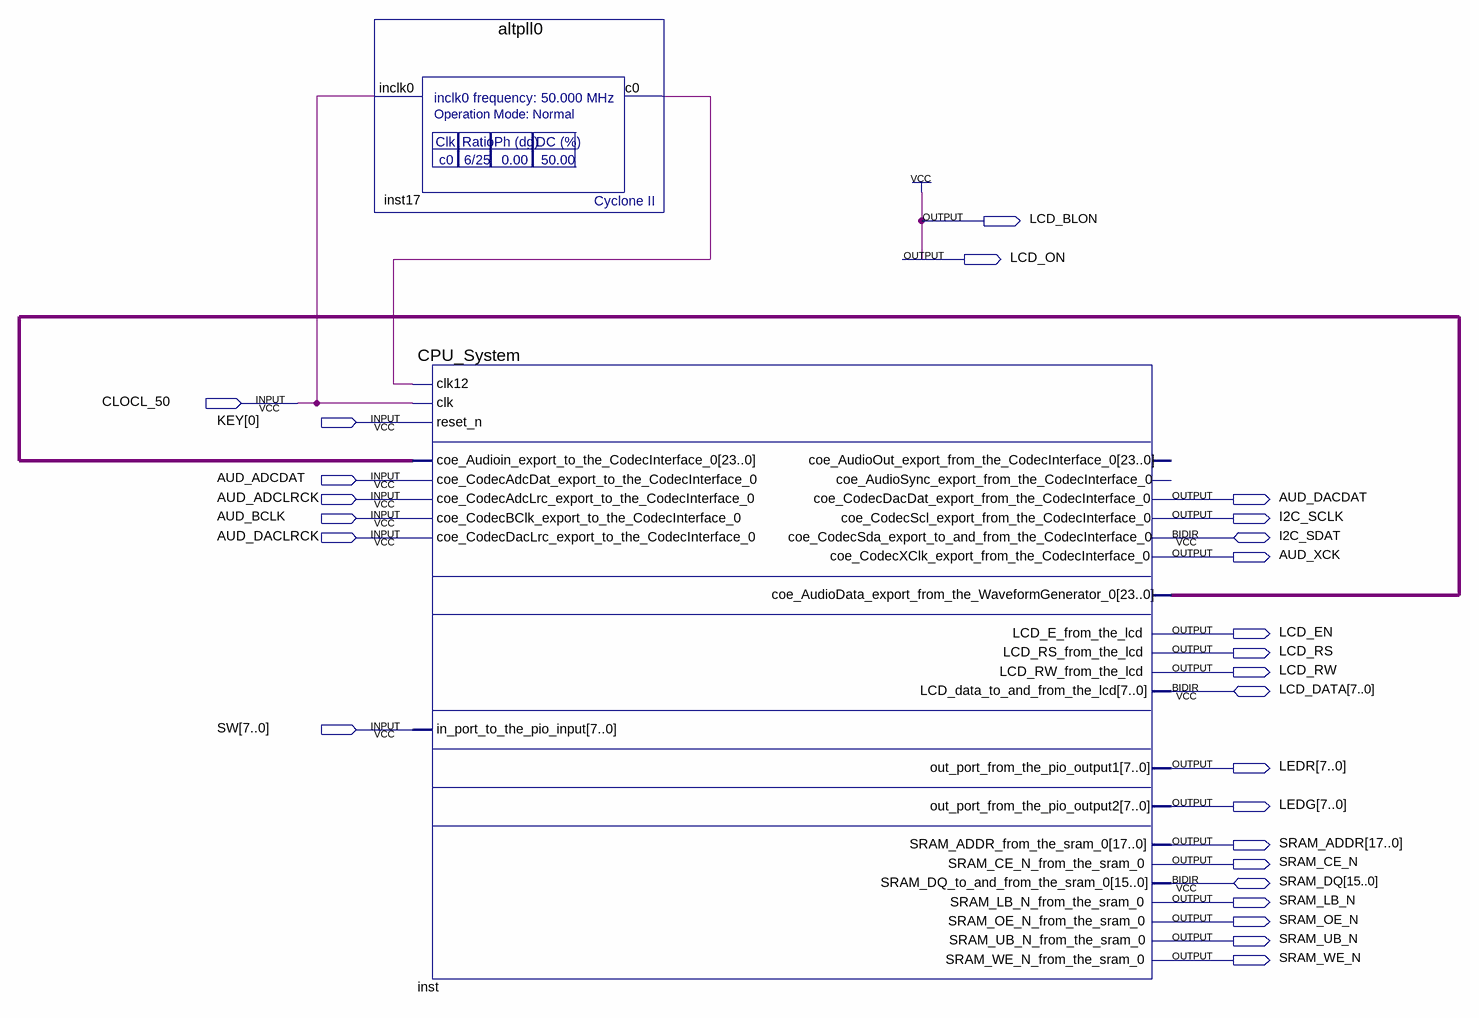
[diagram p0: schematic sheet]
// Quartus schematic AMVE_TopLevel.bdf as structural Verilog: 2 symbols, 26 pins
module AMVE_TopLevel (
  input  CLOCL_50,
  input  [0:0] KEY,
  input  AUD_ADCDAT,
  input  AUD_ADCLRCK,
  input  AUD_BCLK,
  input  AUD_DACLRCK,
  input  [7:0] SW,
  inout  I2C_SDAT,
  inout  [7:0] LCD_DATA,
  inout  [15:0] SRAM_DQ,
  output LCD_BLON,
  output LCD_ON,
  output AUD_DACDAT,
  output I2C_SCLK,
  output AUD_XCK,
  output LCD_EN,
  output LCD_RS,
  output LCD_RW,
  output [7:0] LEDR,
  output [7:0] LEDG,
  output [17:0] SRAM_ADDR,
  output SRAM_CE_N,
  output SRAM_LB_N,
  output SRAM_OE_N,
  output SRAM_UB_N,
  output SRAM_WE_N
);

  wire inst17_c0;
  wire [23:0] inst_coe_audiodata_export_from_the_waveformgenerator_0;

  altpll0 inst17 (.inclk0(CLOCL_50), .c0(inst17_c0));
  CPU_System inst (
    .clk12(inst17_c0), .clk(CLOCL_50), .reset_n(KEY[0]),
    .coe_Audioin_export_to_the_CodecInterface_0(inst_coe_audiodata_export_from_the_waveformgenerator_0),
    .coe_CodecAdcDat_export_to_the_CodecInterface_0(AUD_ADCDAT),
    .coe_CodecAdcLrc_export_to_the_CodecInterface_0(AUD_ADCLRCK),
    .coe_CodecBClk_export_to_the_CodecInterface_0(AUD_BCLK),
    .coe_CodecDacLrc_export_to_the_CodecInterface_0(AUD_DACLRCK), .in_port_to_the_pio_input(SW),
    .coe_CodecDacDat_export_from_the_CodecInterface_0(AUD_DACDAT),
    .coe_CodecScl_export_from_the_CodecInterface_0(I2C_SCLK),
    .coe_CodecXClk_export_from_the_CodecInterface_0(AUD_XCK),
    .coe_AudioData_export_from_the_WaveformGenerator_0(inst_coe_audiodata_export_from_the_waveformgenerator_0),
    .LCD_E_from_the_lcd(LCD_EN), .LCD_RS_from_the_lcd(LCD_RS), .LCD_RW_from_the_lcd(LCD_RW),
    .out_port_from_the_pio_output1(LEDR), .out_port_from_the_pio_output2(LEDG),
    .SRAM_ADDR_from_the_sram_0(SRAM_ADDR), .SRAM_CE_N_from_the_sram_0(SRAM_CE_N),
    .SRAM_LB_N_from_the_sram_0(SRAM_LB_N), .SRAM_OE_N_from_the_sram_0(SRAM_OE_N),
    .SRAM_UB_N_from_the_sram_0(SRAM_UB_N), .SRAM_WE_N_from_the_sram_0(SRAM_WE_N),
    .coe_CodecSda_export_to_and_from_the_CodecInterface_0(I2C_SDAT), .LCD_data_to_and_from_the_lcd(LCD_DATA),
    .SRAM_DQ_to_and_from_the_sram_0(SRAM_DQ));  // open: coe_AudioOut_export_from_the_CodecInterface_0, coe_AudioSync_export_from_the_CodecInterface_0

  assign LCD_BLON = 1'b1;
  assign LCD_ON = 1'b1;
endmodule
